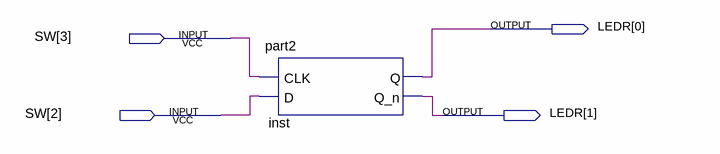
[diagram p0: schematic sheet]
// Quartus schematic part2_sch.bdf as structural Verilog: 1 symbols, 4 pins
module part2_sch (
  input  [3:2] SW,
  output [1:0] LEDR
);

  part2 inst (.CLK(SW[3]), .D(SW[2]), .Q(LEDR[0]), .Q_n(LEDR[1]));
endmodule
